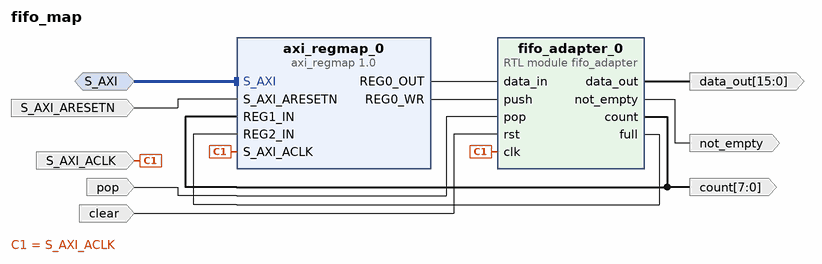
[diagram p0: block diagram of the top level]
# Vivado block design fifo_map, xc7z020clg400-1, Vivado 2021.1
create_bd_design fifo_map

create_bd_intf_port -mode Slave -vlnv xilinx.com:interface:aximm_rtl:1.0 S_AXI
set_property -dict [list \
  CONFIG.ADDR_WIDTH 16 \
  CONFIG.ARUSER_WIDTH 0 \
  CONFIG.AWUSER_WIDTH 0 \
  CONFIG.BUSER_WIDTH 0 \
  CONFIG.DATA_WIDTH 32 \
  CONFIG.HAS_BRESP 1 \
  CONFIG.HAS_BURST 0 \
  CONFIG.HAS_CACHE 0 \
  CONFIG.HAS_LOCK 0 \
  CONFIG.HAS_PROT 1 \
  CONFIG.HAS_QOS 0 \
  CONFIG.HAS_REGION 0 \
  CONFIG.HAS_RRESP 1 \
  CONFIG.HAS_WSTRB 1 \
  CONFIG.ID_WIDTH 0 \
  CONFIG.MAX_BURST_LENGTH 1 \
  CONFIG.NUM_READ_OUTSTANDING 1 \
  CONFIG.NUM_READ_THREADS 1 \
  CONFIG.NUM_WRITE_OUTSTANDING 1 \
  CONFIG.NUM_WRITE_THREADS 1 \
  CONFIG.PROTOCOL AXI4LITE \
  CONFIG.READ_WRITE_MODE READ_WRITE \
  CONFIG.RUSER_BITS_PER_BYTE 0 \
  CONFIG.RUSER_WIDTH 0 \
  CONFIG.SUPPORTS_NARROW_BURST 0 \
  CONFIG.WUSER_BITS_PER_BYTE 0 \
  CONFIG.WUSER_WIDTH 0 \
] [get_bd_intf_ports S_AXI]
create_bd_port -dir I -type clk S_AXI_ACLK
set_property -dict {CONFIG.ASSOCIATED_BUSIF S_AXI} [get_bd_ports S_AXI_ACLK]
create_bd_port -dir I -type rst S_AXI_ARESETN
create_bd_port -dir I pop
create_bd_port -dir I -type rst clear
set_property -dict {CONFIG.POLARITY ACTIVE_HIGH} [get_bd_ports clear]
create_bd_port -dir O -from 15 -to 0 data_out
create_bd_port -dir O not_empty
create_bd_port -dir O -from 7 -to 0 -type data count

create_bd_cell -type ip -vlnv SHREC:SHREC:axi_regmap:1.0 axi_regmap_0
set_property -dict {CONFIG.NUM_REGS 3 CONFIG.WIDTH0 16 CONFIG.WIDTH1 8 CONFIG.WIDTH2 1} [get_bd_cells axi_regmap_0]
create_bd_cell -type module -reference fifo_adapter fifo_adapter_0

# ---- connections ----

connect_bd_intf_net -intf_net S_AXI_0_1 [get_bd_intf_ports S_AXI] [get_bd_intf_pins axi_regmap_0/S_AXI]
connect_bd_net -net S_AXI_ACLK_0_1 [get_bd_ports S_AXI_ACLK] [get_bd_pins axi_regmap_0/S_AXI_ACLK] [get_bd_pins fifo_adapter_0/clk]
connect_bd_net -net S_AXI_ARESETN_0_1 [get_bd_ports S_AXI_ARESETN] [get_bd_pins axi_regmap_0/S_AXI_ARESETN]
connect_bd_net [get_bd_pins axi_regmap_0/REG0_OUT] [get_bd_pins fifo_adapter_0/data_in]
connect_bd_net [get_bd_pins axi_regmap_0/REG0_WR] [get_bd_pins fifo_adapter_0/push]
connect_bd_net [get_bd_pins fifo_adapter_0/count] [get_bd_pins axi_regmap_0/REG1_IN] [get_bd_ports count]
connect_bd_net [get_bd_pins fifo_adapter_0/data_out] [get_bd_ports data_out]
connect_bd_net -net fifo_adapter_0_empty [get_bd_pins fifo_adapter_0/not_empty] [get_bd_ports not_empty]
connect_bd_net [get_bd_pins fifo_adapter_0/full] [get_bd_pins axi_regmap_0/REG2_IN]
connect_bd_net -net pop_0_1 [get_bd_ports pop] [get_bd_pins fifo_adapter_0/pop]
connect_bd_net -net rst_0_1 [get_bd_ports clear] [get_bd_pins fifo_adapter_0/rst]

validate_bd_design
save_bd_design
